# EAGLE schematic Parlante (EAGLE 9.5.0)
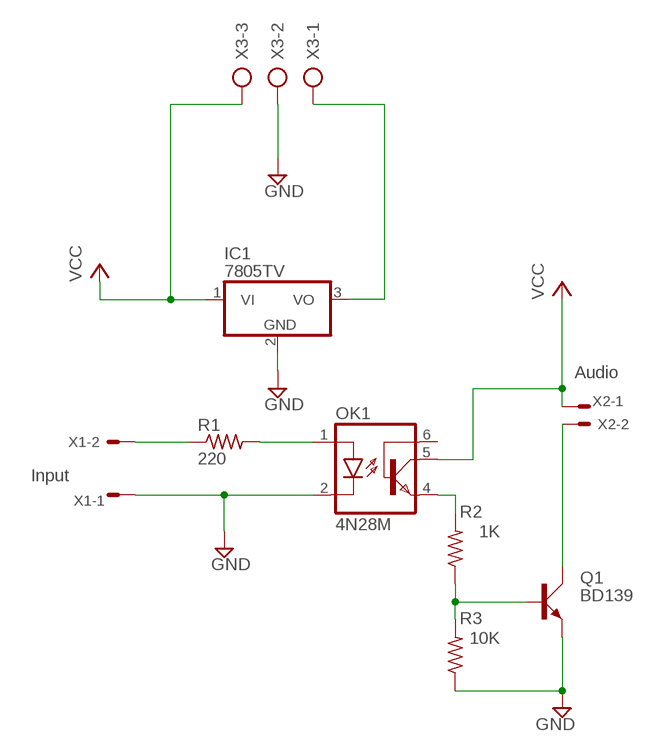
[diagram p0: schematic, sheet 1]

## Parts
IC1  7805TV  [TO220V]
OK1  4N28M  [DIL06]
Q1  BD139  [TO126AV]
R1  220  R-US_0204/7  [0204/7]
R2  1K  R-US_0204/7  [0204/7]
R3  10K  R-US_0204/7  [0204/7]
X1  Input  22-23-2021  [22-23-2021]
X2  Audio  22-23-2021  [22-23-2021]
X3  AK500/3  [AK500/3]

## Nets
GND: IC1.2(GND) OK1.2(C) Q1.E R3.1 X1.1 X3.2
N$1: R1.1 X1.2
N$2: OK1.1(A) R1.2
N$3: Q1.B R2.1 R3.2
N$4: OK1.4(EMI) R2.2
N$5: IC1.3(VO) X3.1
N$6: Q1.C X2.2
VCC: IC1.1(VI) OK1.5(COL) X2.1 X3.3
Unconnected: OK1.6(BAS)

## Library data of the parts
IC1 = linear:78*: Positive VOLTAGE REGULATOR Source: http://cache.national.com/ds/LM/LM78L05.pdf http://www.fairchildsemi.com/ds/LM/LM7805.pdf
OK1 = optocoupler:4N*?M: General Purpose 6-Pin Phototransistor Optocouplers Source: http://www.fairchildsemi.com/ds/4N/4N35-M.pdf; MF: FAIRCHILD SEMICONDUCTOR; MPN: 4N28-M; OC_FARNELL: 1504445; OC_NEWARK: 05C3313
Q1 = transistor-power:BD139: NPN TRANSISTOR
R1-R3 = rcl:R-US_: RESISTOR, American symbol; SPICEPREFIX: R
X1 X2 = con-molex:22-23-2021: .100" (2.54mm) Center Header - 2 Pin; MF: MOLEX; MPN: 22-23-2021; OC_FARNELL: 1462926; OC_NEWARK: 25C3832
X3 = con-ptr500:AK500/3: CONNECTOR; OC_FARNELL: unknown; OC_NEWARK: unknown